# Altium schematic sheet powerSupply.SchDoc
size C
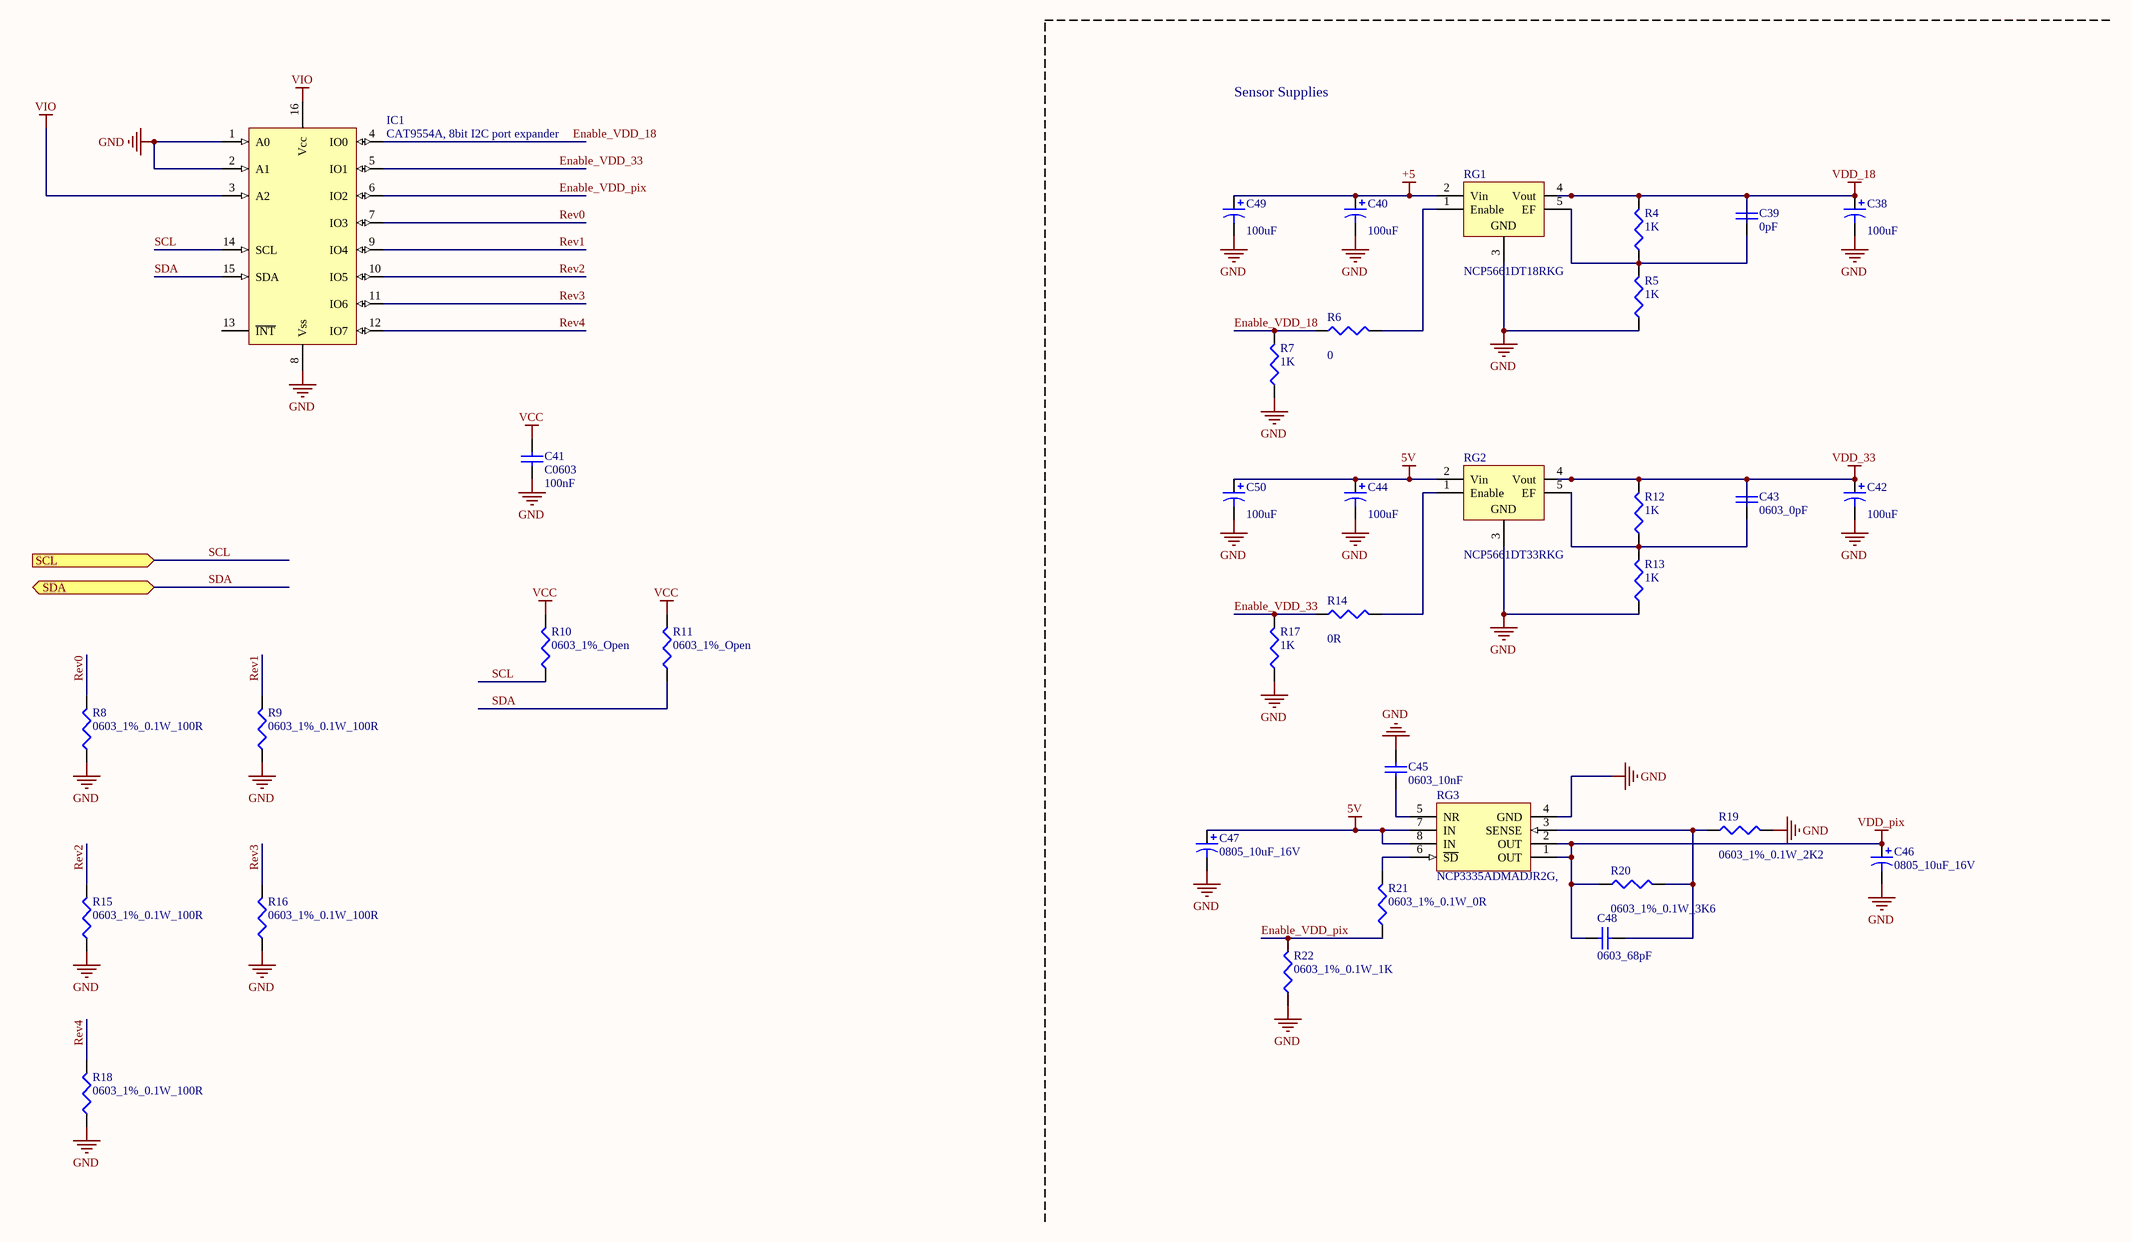
[diagram p0: powerSupply.SchDoc]

## Parts
C38  value 100uF  [CC3225-1210]  (hidden comment: T494B)
C39  value 0pF  [0603]  (hidden comment: C0603)
C40  value 100uF  [CC3225-1210]  (hidden comment: T494B)
C41  C0603  value 100nF  [0603]
C42  value 100uF  [CC3225-1210]  (hidden comment: T494B)
C43  value 0603_0pF  [0603]  (hidden comment: C0603)
C44  value 100uF  [CC3225-1210]  (hidden comment: T494B)
C45  value 0603_10nF  [0603]  (hidden comment: C0603)
C46  value 0805_10uF_16V  [C0805]  (hidden comment: Cap Pol3)
C47  value 0805_10uF_16V  [C0805]  (hidden comment: Cap Pol3)
C48  value 0603_68pF  [0603]  (hidden comment: C0603)
C49  value 100uF  [CC3225-1210]  (hidden comment: T494B)
C50  value 100uF  [CC3225-1210]  (hidden comment: T494B)
IC1  CAT9554A, 8bit I2C port expander  [TSSOP16_N]
R4  value 1K  [J1-0603]  (hidden comment: Res3)
R5  value 1K  [J1-0603]  (hidden comment: Res3)
R6  value 0  [J1-0603]  (hidden comment: Res3)
R7  value 1K  [J1-0603]  (hidden comment: Res3)
R8  value 0603_1%_0.1W_100R  [J1-0603]  (hidden comment: Res3)
R9  value 0603_1%_0.1W_100R  [J1-0603]  (hidden comment: Res3)
R10  value 0603_1%_Open  [J1-0603]  (hidden comment: Res3)
R11  value 0603_1%_Open  [J1-0603]  (hidden comment: Res3)
R12  value 1K  [J1-0603]  (hidden comment: Res3)
R13  value 1K  [J1-0603]  (hidden comment: Res3)
R14  value 0R  [J1-0603]  (hidden comment: Res3)
R15  value 0603_1%_0.1W_100R  [J1-0603]  (hidden comment: Res3)
R16  value 0603_1%_0.1W_100R  [J1-0603]  (hidden comment: Res3)
R17  value 1K  [J1-0603]  (hidden comment: Res3)
R18  value 0603_1%_0.1W_100R  [J1-0603]  (hidden comment: Res3)
R19  value 0603_1%_0.1W_2K2  [J1-0603]  (hidden comment: Res3)
R20  value 0603_1%_0.1W_3K6  [J1-0603]  (hidden comment: Res3)
R21  value 0603_1%_0.1W_0R  [J1-0603]  (hidden comment: Res3)
R22  value 0603_1%_0.1W_1K  [J1-0603]  (hidden comment: Res3)
RG1  NCP5661DT18RKG  [D-PAK SIP-G5/Z10.9]
RG2  NCP5661DT33RKG  [D-PAK SIP-G5/Z10.9]
RG3  NCP3335ADMADJR2G,  [ONSC-MICRO-8-846A-02_H_V]

## Ports
SCL (in), SDA (bidir)

## Nets
5V: C44.1 C47.1 C50.1 RG2.2(Vin) RG3.7(IN) RG3.8(IN)
+5: C40.1 C49.1 RG1.2(Vin)
GND: C38.2 C40.2 C41.1 C42.2 C44.2 C45.2 C46.2 C47.2 C49.2 C50.2 IC1.1(A0) IC1.2(A1) IC1.8(Vss) R5.1 R7.1 R8.1 R9.1 R13.1 R15.1 R16.1 R17.1 R18.1 R19.2 R22.1 RG1.3(GND) RG2.3(GND) RG3.4(GND)
VCC: C41.2 R10.2 R11.2
VDD_18: C38.1 C39.2 R4.2 RG1.4(Vout)
VDD_33: C42.1 C43.2 R12.2 RG2.4(Vout)
VDD_pix: C46.1 C48.1 R20.1 RG3.1(OUT) RG3.2(OUT)
VIO: IC1.3(A2) IC1.16(Vcc)
Enable_VDD_18: IC1.4(IO0) R6.1 R7.2
Enable_VDD_33: IC1.5(IO1) R14.1 R17.2
Enable_VDD_pix: IC1.6(IO2) R21.1 R22.2
Rev0: IC1.7(IO3) R8.2
Rev1: IC1.9(IO4) R9.2
Rev2: IC1.10(IO5) R15.2
Rev3: IC1.11(IO6) R16.2
Rev4: IC1.12(IO7) R18.2
SCL: IC1.14(SCL) R10.1 ; port SCL
SDA: IC1.15(SDA) R11.1 ; port SDA
NetC39_1: C39.1 R4.1 R5.2 RG1.5(EF)
NetC43_1: C43.1 R12.1 R13.2 RG2.5(EF)
NetC45_1: C45.1 RG3.5(NR)
NetC48_2: C48.2 R19.1 R20.2 RG3.3(SENSE)
NetR6_2: R6.2 RG1.1(Enable)
NetR14_2: R14.2 RG2.1(Enable)
NetR21_2: R21.2 RG3.6(~{SD})

Not connected (* = marked no-connect by the designer): IC1 13(~{INT})

## Notes on the sheet
- Sensor Supplies

## Library data of the parts
C38 C40 C42 C44 C49 C50 = T494B: Solid Tantalum Chip Capacitor, Standard T494 Series - Low ESR, Industrial Grade; Published: 17-Jul-2002; LatestRevisionDate: 19-Mar-2004; LatestRevisionNote: Silkscreen dimensions re-sized.; DatasheetDocument: Mar-2001; PackageDocument: Mar-2001; PackageReference: B; Publisher: Altium Limited; Code_JEITA: 3528-21; ComponentLink1Description: Manufacturer Link; ComponentLink1URL: http://www.kemet.com/; ComponentLink2Description: Datasheet; ComponentLink2URL: http://www.kemet.com/kemet/web/homepage/kechome.nsf/vapubfilesname/F3102TA.pdf/$file/F3102TA.pdf
C39 C41 C43 C45 C48 = C0603: Ceramic Chip Capacitor - Standard; Note: Footprint corresponds to dimensions for bulk cassette packaging. This case size has tightened tolerances.; Published: 17-Jul-2002; LatestRevisionDate: 19-Mar-2004; LatestRevisionNote: Silkscreen size reduced.; DatasheetDocument: Mar-2001; PackageDocument: Mar-2001; PackageReference: 0603; Publisher: Altium Limited; Code_JEITA: 0603; Code_IPC: 1608 [0603]; ComponentLink1Description: Manufacturer Link; ComponentLink1URL: http://www.kemet.com/; ComponentLink2Description: Datasheet; ComponentLink2URL: http://www.kemet.com/kemet/web/homepage/kechome.nsf/vapubfilesname/F3102TA.pdf/$file/F3102TA.pdf
C46 C47 = Cap Pol3: Polarized Capacitor (Surface Mount); Published: 8-Jun-2000; LatestRevisionDate: 29-May-2009; LatestRevisionNote: IPC-7351 Footprint Added.; PackageReference: C0805; Publisher: Altium Limited; PackageDescription: Chip Capacitor
IC1 = CAT9554A: 8bit I2C port expander; Published: 16-Jan-2001; LatestRevisionDate: 13-Apr-2006; LatestRevisionNote: IPC-7351 Footprint Added.; DatasheetVersion: 1996; PackageReference: WSO16; Publisher: Altium Limited; PackageDescription: 16-Pin Small Outline Integrated Circuit 1.27 mm Pitch; Code_JEDEC: MS-013-AA; Code_IPC: SOIC127P1030-16; ComponentLink1Description: Manufacturer Link; ComponentLink1URL: http://www.maxim-ic.com/; ComponentLink2Description: Datasheet; ComponentLink2URL: http://pdfserv.maxim-ic.com/en/ds/DG300A-DG303A.pdf
R4-R22 = Res3: Resistor; Published: 8-Jun-2000; LatestRevisionDate: 29-May-2009; LatestRevisionNote: IPC-7351 Footprint Added.; PackageReference: J1-0603; Publisher: Altium Limited; PackageDescription: Chip Resistor
RG1 RG2 = NCP5661: Low Dropout Voltage Regulator; Note: Heatsink surface is connected to Pin 3; Published: 15-Apr-2002; DatasheetVersion: 1997; PackageVersion: 1997; PackageReference: 314A-03; Publisher: Altium Limited; PackageDescription: TO, Thru-Hole, Horizontal, Heatsink Mounted; 5 Bent Staggered Leads; Pitch 1.7 mm; ComponentLink1Description: Manufacturer Link; ComponentLink1URL: http://www.onsemi.com/site/products/taxonomy/0,4438,503,00.html; ComponentLink2Description: Datasheet; ComponentLink2URL: http://www.onsemi.com/pub/Collateral/LM2931-D.PDF
RG3 = NCP3335: NCP3335ADMADJR2G, ADJ Ultra High Accuracy, Low Iq, 500 mA Low Dropout Regulator; Published: 15-Apr-2002; LatestRevisionDate: 13-Apr-2006; LatestRevisionNote: IPC-7351 Footprint Added.; DatasheetVersion: 1998; PackageVersion: 1998; PackageReference: 751-05; Publisher: Altium Limited; PackageDescription: 8-Pin Small Outline Integrated Circuit 1.27 mm Pitch; Code_JEDEC: MS-012-AA; Code_IPC: SOIC127P600-8; ComponentLink1Description: Manufacturer Link; ComponentLink1URL: http://www.onsemi.com/site/products/taxonomy/0,4438,503,00.html; ComponentLink2Description: Datasheet; ComponentLink2URL: http://www.onsemi.com/pub/Collateral/MC33264-D.PDF